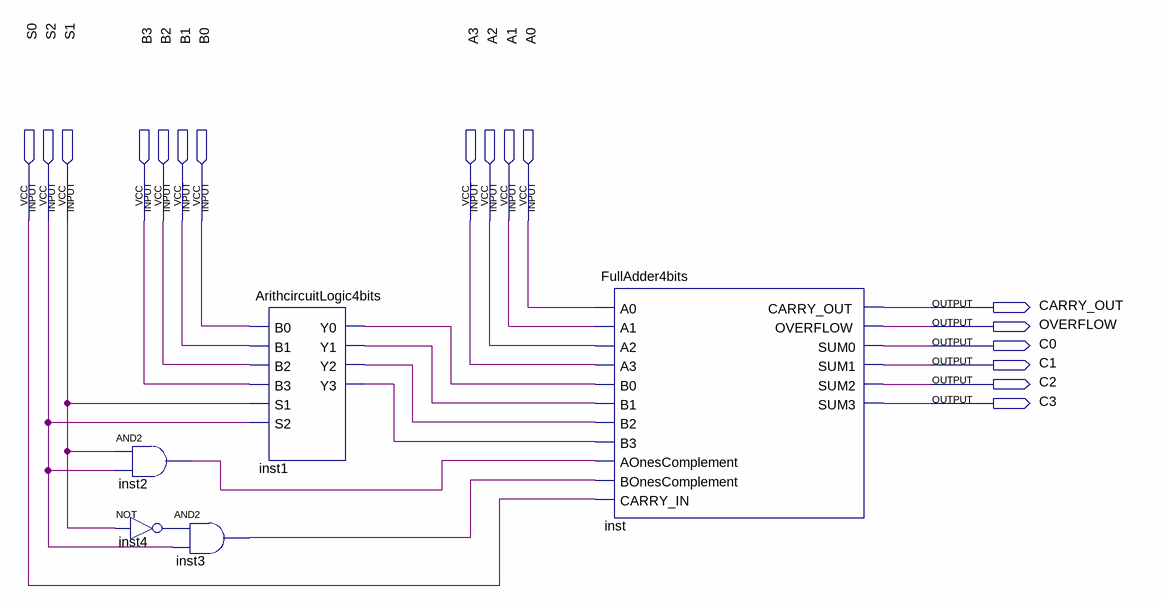
[diagram p0: schematic sheet]
// Quartus schematic Arithcircuit4bits.bdf as structural Verilog: 5 symbols, 17 pins
module Arithcircuit4bits (
  input  S0,
  input  S2,
  input  S1,
  input  B3,
  input  B2,
  input  B1,
  input  B0,
  input  A3,
  input  A2,
  input  A1,
  input  A0,
  output CARRY_OUT,
  output OVERFLOW,
  output C0,
  output C1,
  output C2,
  output C3
);

  wire inst1_y0, inst1_y1, inst1_y2, inst1_y3, inst2_out, inst3_out, inst4_out;

  and inst2 (inst2_out, S1, S2);
  not inst4 (inst4_out, S1);
  and inst3 (inst3_out, inst4_out, S2);
  ArithcircuitLogic4bits inst1 (
    .B0(B0), .B1(B1), .B2(B2), .B3(B3), .S1(S1), .S2(S2), .Y0(inst1_y0), .Y1(inst1_y1), .Y2(inst1_y2),
    .Y3(inst1_y3));
  FullAdder4bits inst (
    .A0(A0), .A1(A1), .A2(A2), .A3(A3), .B0(inst1_y0), .B1(inst1_y1), .B2(inst1_y2), .B3(inst1_y3),
    .AOnesComplement(inst2_out), .BOnesComplement(inst3_out), .CARRY_IN(S0), .CARRY_OUT(CARRY_OUT),
    .OVERFLOW(OVERFLOW), .SUM0(C0), .SUM1(C1), .SUM2(C2), .SUM3(C3));
endmodule
